# Altium schematic sheet MCU.SchDoc
size A3; SheetNumber: 2; SheetTotal: 5
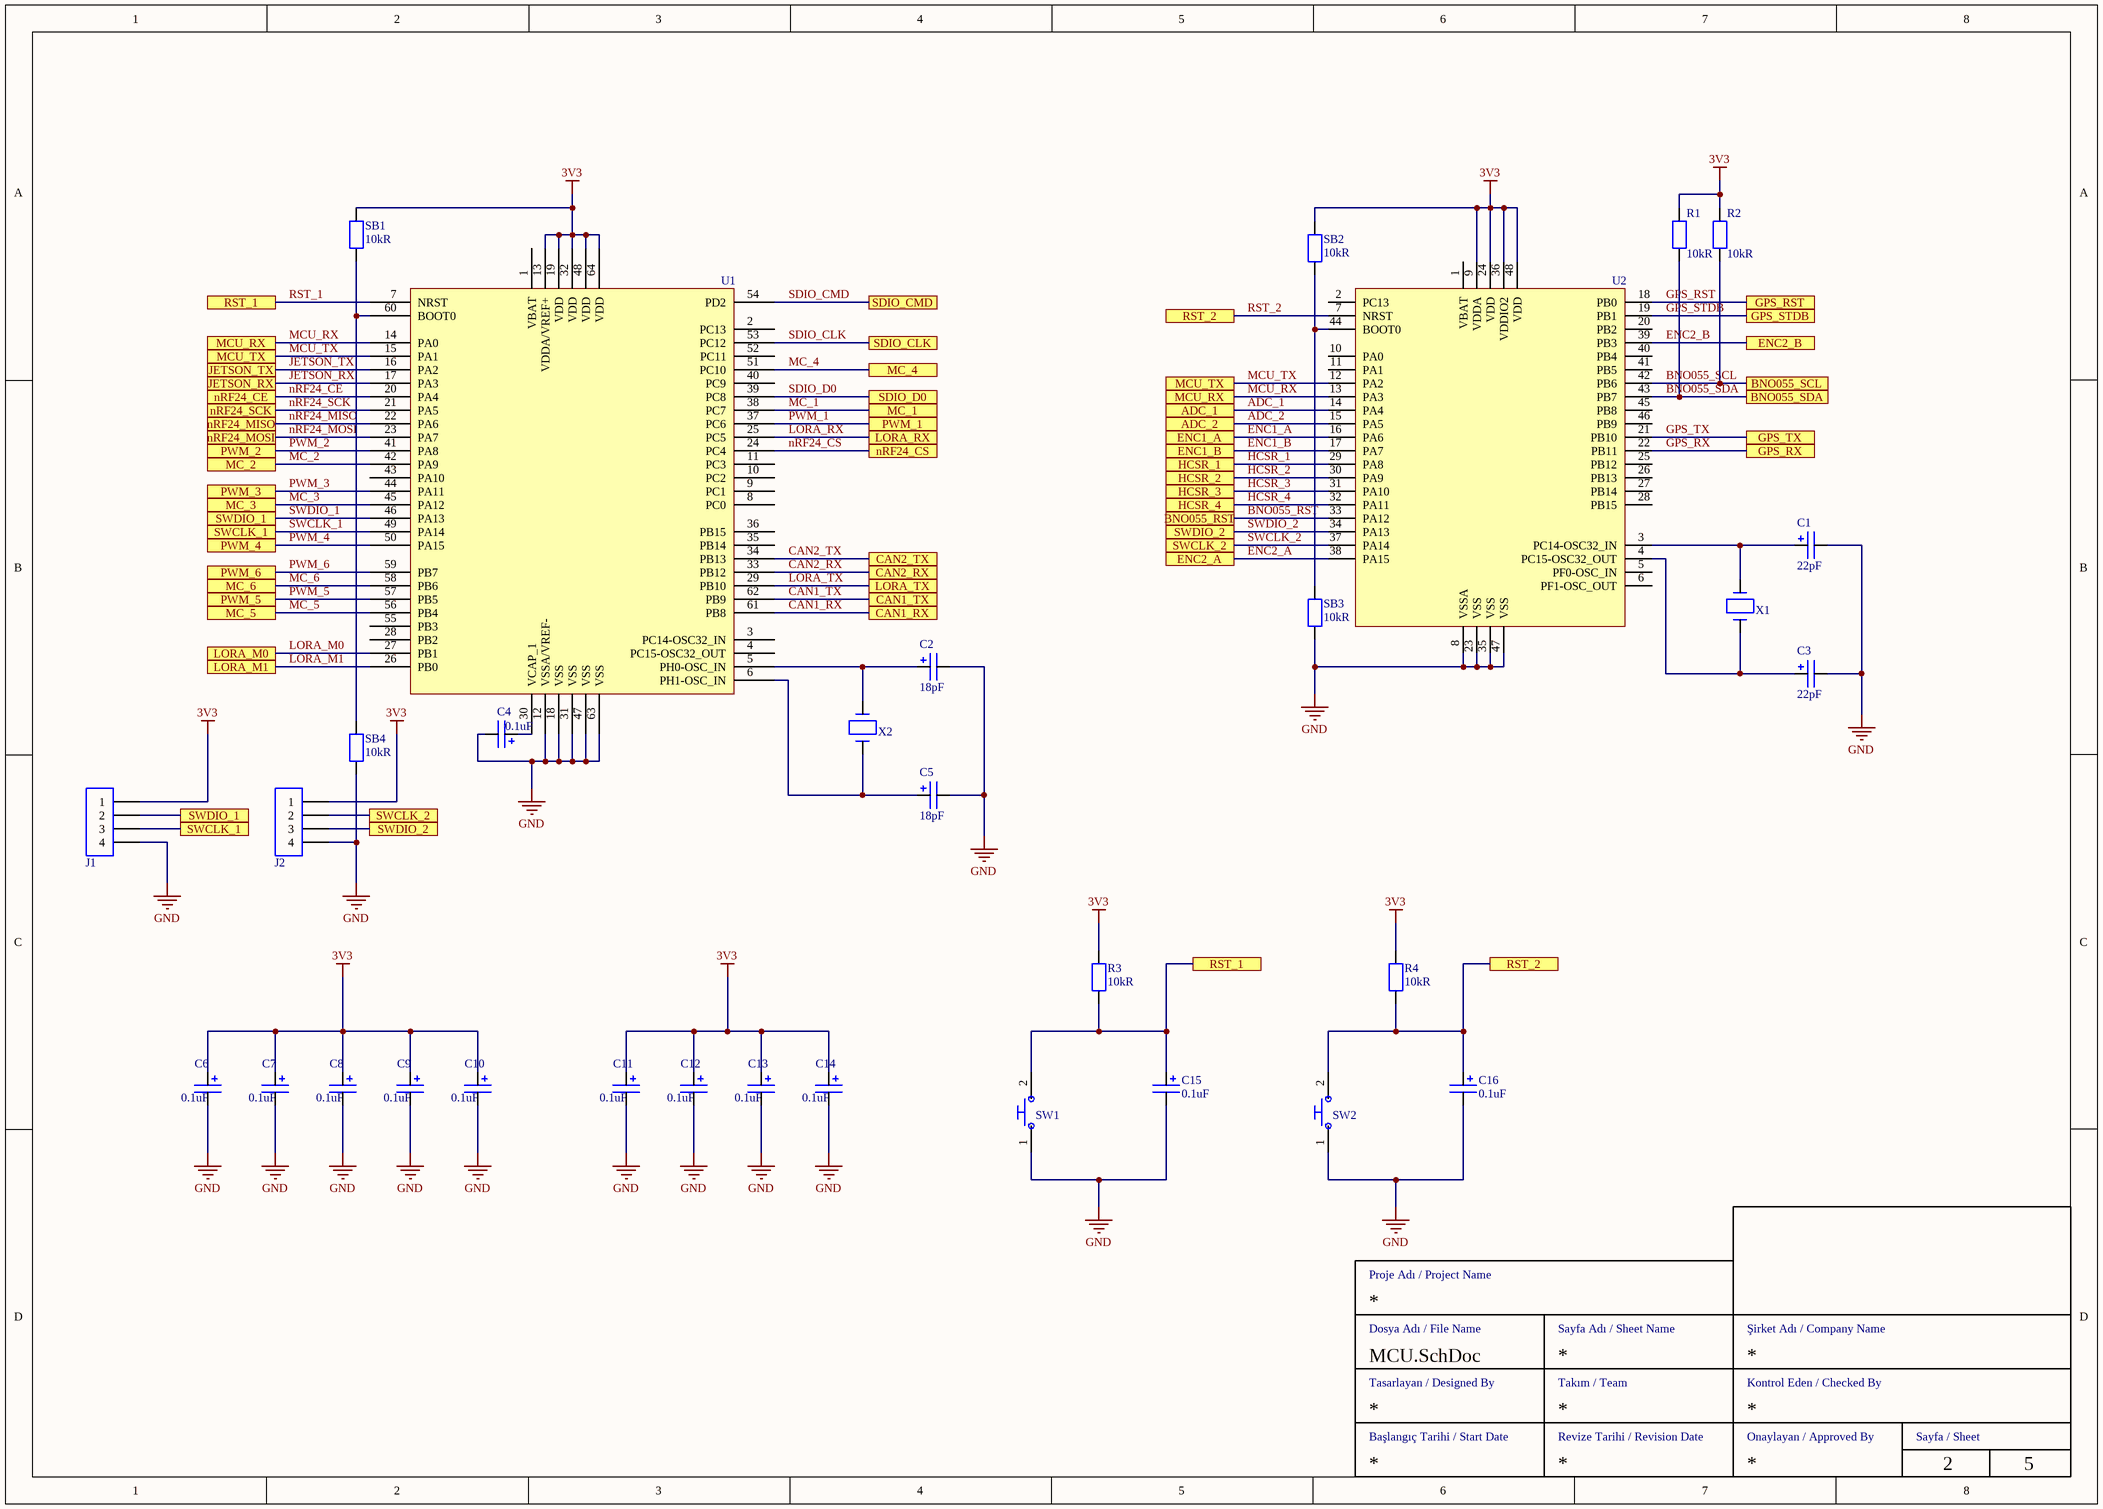
[diagram p0: MCU.SchDoc]

## Parts
C1  value 22pF  [CAP 0603]  (hidden comment: CAP 0603)
C2  value 18pF  [CAP 0603]  (hidden comment: CAP 0603)
C3  value 22pF  [CAP 0603]  (hidden comment: CAP 0603)
C4  value 0.1uF  [CAP 0603]  (hidden comment: CAP 0603)
C5  value 18pF  [CAP 0603]  (hidden comment: CAP 0603)
C6  value 0.1uF  [CAP 0603]  (hidden comment: CAP 0603)
C7  value 0.1uF  [CAP 0603]  (hidden comment: CAP 0603)
C8  value 0.1uF  [CAP 0603]  (hidden comment: CAP 0603)
C9  value 0.1uF  [CAP 0603]  (hidden comment: CAP 0603)
C10  value 0.1uF  [CAP 0603]  (hidden comment: CAP 0603)
C11  value 0.1uF  [CAP 0603]  (hidden comment: CAP 0603)
C12  value 0.1uF  [CAP 0603]  (hidden comment: CAP 0603)
C13  value 0.1uF  [CAP 0603]  (hidden comment: CAP 0603)
C14  value 0.1uF  [CAP 0603]  (hidden comment: CAP 0603)
C15  value 0.1uF  [CAP 0603]  (hidden comment: CAP 0603)
C16  value 0.1uF  [CAP 0603]  (hidden comment: CAP 0603)
J1  146285-4  [HMATHT00C41]  (value not drawn)
J2  146285-4  [HMATHT00C41]  (value not drawn)
R1  value 10kR  [RESISTOR 0603]  (hidden comment: RES 0603)
R2  value 10kR  [RESISTOR 0603]  (hidden comment: RES 0603)
R3  value 10kR  [RESISTOR 0603]  (hidden comment: RES 0603)
R4  value 10kR  [RESISTOR 0603]  (hidden comment: RES 0603)
SB1  value 10kR  [RESISTOR 0603]  (hidden comment: RES 0603)
SB2  value 10kR  [RESISTOR 0603]  (hidden comment: RES 0603)
SB3  value 10kR  [RESISTOR 0603]  (hidden comment: RES 0603)
SB4  value 10kR  [RESISTOR 0603]  (hidden comment: RES 0603)
SW1  DS1042-03  [SWITCH-6X6]  (value not drawn)
SW2  DS1042-03  [SWITCH-6X6]  (value not drawn)
U1  STM32F446xC  [LQFP64]  (value not drawn)
U2  STM32F072C8  [LQFP48]  (value not drawn)
X1  RSM200S-32.768  [4-SOJ]  (value not drawn)
X2  ABM3-8.000  [2-SMD]  (value not drawn)

## Ports
ADC_1, ADC_2, BNO055_RST, BNO055_SCL, BNO055_SDA, CAN1_RX, CAN1_TX, CAN2_RX, CAN2_TX, ENC1_A, ENC1_B, ENC2_A, ENC2_B, GPS_RST, GPS_RX, GPS_STDB, GPS_TX, HCSR_1, HCSR_2, HCSR_3, HCSR_4, JETSON_RX, JETSON_TX, LORA_M0, LORA_M1, LORA_RX, LORA_TX, MC_1, MC_2, MC_3, MC_4, MC_5, MC_6, MCU_RX, MCU_TX, nRF24_CE, nRF24_CS, nRF24_MISO, nRF24_MOSI, nRF24_SCK, PWM_1, PWM_2, PWM_3, PWM_4, PWM_5, PWM_6, RST_1, RST_2, SDIO_CLK, SDIO_CMD, SDIO_D0, SWCLK_1, SWCLK_2, SWDIO_1, SWDIO_2

## Nets
3V3: C6.1 C7.1 C8.1 C9.1 C10.1 C11.1 C12.1 C13.1 C14.1 J1.1 J2.1 R1.2 R2.2 R3.2 R4.2 SB1.2 SB2.2 U1.13(VDDA/VREF+) U1.19(VDD) U1.32(VDD) U1.48(VDD) U1.64(VDD) U2.9(VDDA) U2.24(VDD) U2.36(VDDIO2) U2.48(VDD)
GND: C1.2 C2.2 C3.2 C4.2 C5.2 C6.2 C7.2 C8.2 C9.2 C10.2 C11.2 C12.2 C13.2 C14.2 C15.2 C16.2 J1.4 J2.4 SB3.1 SB4.1 SW1.1 SW2.1 U1.12(VSSA/VREF-) U1.18(VSS) U1.31(VSS) U1.47(VSS) U1.63(VSS) U2.8(VSSA) U2.23(VSS) U2.35(VSS) U2.47(VSS)
ADC_1: U2.14(PA4) ; port ADC_1
ADC_2: U2.15(PA5) ; port ADC_2
BNO055_RST: U2.33(PA12) ; port BNO055_RST
BNO055_SCL: R2.1 U2.42(PB6) ; port BNO055_SCL
BNO055_SDA: R1.1 U2.43(PB7) ; port BNO055_SDA
CAN1_RX: U1.61(PB8) ; port CAN1_RX
CAN1_TX: U1.62(PB9) ; port CAN1_TX
CAN2_RX: U1.33(PB12) ; port CAN2_RX
CAN2_TX: U1.34(PB13) ; port CAN2_TX
ENC1_A: U2.16(PA6) ; port ENC1_A
ENC1_B: U2.17(PA7) ; port ENC1_B
ENC2_A: U2.38(PA15) ; port ENC2_A
ENC2_B: U2.39(PB3) ; port ENC2_B
GPS_RST: U2.18(PB0) ; port GPS_RST
GPS_RX: U2.22(PB11) ; port GPS_RX
GPS_STDB: U2.19(PB1) ; port GPS_STDB
GPS_TX: U2.21(PB10) ; port GPS_TX
HCSR_1: U2.29(PA8) ; port HCSR_1
HCSR_2: U2.30(PA9) ; port HCSR_2
HCSR_3: U2.31(PA10) ; port HCSR_3
HCSR_4: U2.32(PA11) ; port HCSR_4
JETSON_RX: U1.17(PA3) ; port JETSON_RX
JETSON_TX: U1.16(PA2) ; port JETSON_TX
LORA_M0: U1.27(PB1) ; port LORA_M0
LORA_M1: U1.26(PB0) ; port LORA_M1
LORA_RX: U1.25(PC5) ; port LORA_RX
LORA_TX: U1.29(PB10) ; port LORA_TX
MC_1: U1.38(PC7) ; port MC_1
MC_2: U1.42(PA9) ; port MC_2
MC_3: U1.45(PA12) ; port MC_3
MC_4: U1.51(PC10) ; port MC_4
MC_5: U1.56(PB4) ; port MC_5
MC_6: U1.58(PB6) ; port MC_6
MCU_RX: U1.14(PA0) U2.13(PA3) ; port MCU_RX
MCU_TX: U1.15(PA1) U2.12(PA2) ; port MCU_TX
nRF24_CE: U1.20(PA4) ; port nRF24_CE
nRF24_CS: U1.24(PC4) ; port nRF24_CS
nRF24_MISO: U1.22(PA6) ; port nRF24_MISO
nRF24_MOSI: U1.23(PA7) ; port nRF24_MOSI
nRF24_SCK: U1.21(PA5) ; port nRF24_SCK
PWM_1: U1.37(PC6) ; port PWM_1
PWM_2: U1.41(PA8) ; port PWM_2
PWM_3: U1.44(PA11) ; port PWM_3
PWM_4: U1.50(PA15) ; port PWM_4
PWM_5: U1.57(PB5) ; port PWM_5
PWM_6: U1.59(PB7) ; port PWM_6
RST_1: C15.1 R3.1 SW1.2 U1.7(NRST) ; port RST_1
RST_2: C16.1 R4.1 SW2.2 U2.7(NRST) ; port RST_2
SDIO_CLK: U1.53(PC12) ; port SDIO_CLK
SDIO_CMD: U1.54(PD2) ; port SDIO_CMD
SDIO_D0: U1.39(PC8) ; port SDIO_D0
SWCLK_1: J1.3 U1.49(PA14) ; port SWCLK_1
SWCLK_2: J2.2 U2.37(PA14) ; port SWCLK_2
SWDIO_1: J1.2 U1.46(PA13) ; port SWDIO_1
SWDIO_2: J2.3 U2.34(PA13) ; port SWDIO_2
NetC1_1: C1.1 U2.3(PC14-OSC32_IN) X1.1
NetC2_1: C2.1 U1.5(PH0-OSC_IN) X2.1
NetC3_1: C3.1 U2.4(PC15-OSC32_OUT) X1.4
NetC4_1: C4.1 U1.30(VCAP_1)
NetC5_1: C5.1 U1.6(PH1-OSC_IN) X2.2
NetSB1_1: SB1.1 SB4.2 U1.60(BOOT0)
NetSB2_1: SB2.1 SB3.2 U2.44(BOOT0)

Not connected (* = marked no-connect by the designer): U1 1(VBAT) 2(PC13) 3(PC14-OSC32_IN) 4(PC15-OSC32_OUT) 8(PC0) 9(PC1) 10(PC2) 11(PC3) 28(PB2) 35(PB14) 36(PB15) 40(PC9) 43(PA10) 52(PC11) 55(PB3); U2 1(VBAT) 2(PC13) 5(PF0-OSC_IN) 6(PF1-OSC_OUT) 10(PA0) 11(PA1) 20(PB2) 25(PB12) 26(PB13) 27(PB14) 28(PB15) 40(PB4) 41(PB5) 45(PB8) 46(PB9)

## Notes on the sheet
- Dosya Adı / File Name
- Proje Adı / Project Name
- Sayfa Adı / Sheet Name
- Şirket Adı / Company Name
- Tasarlayan / Designed By
- Takım / Team
- Kontrol Eden / Checked By
- Başlangıç Tarihi / Start Date
- Revize Tarihi / Revision Date
- Onaylayan / Approved By
- Sayfa / Sheet

## Library data of the parts
C1-C16 = CAP 0603: Multilayer Ceramic Capacitor; Capacitor Type: MLCC; Case/Package: 0603
J1 J2 = HMATHT00C41: Header for PCB
R1-R4 SB1-SB4 = RES 0603: SMD Chip Resistor; Case/Package: 0603
SW1 SW2 = DS1042-03: Switch
U1 = STM32F446xC: STM32 ARM Cortex M4; Case/Package: LQFP; Pins: 64; Category: MCU
U2 = STM32F072C8: STM32 ARM Cortex M0; Case/Package: LQFP; Pins: 48; Category: MCU
X1 = RSM200S-32.768: CRYSTAL; Capacitance: 12.5pF
X2 = ABM3-8.000: CRYSTAL; Frequency: 8MHz; Capacitance: 18pF; Case/Package: 2-SMD